# EAGLE design Flipper-ESP32-S2 (EAGLE 7.7.0)
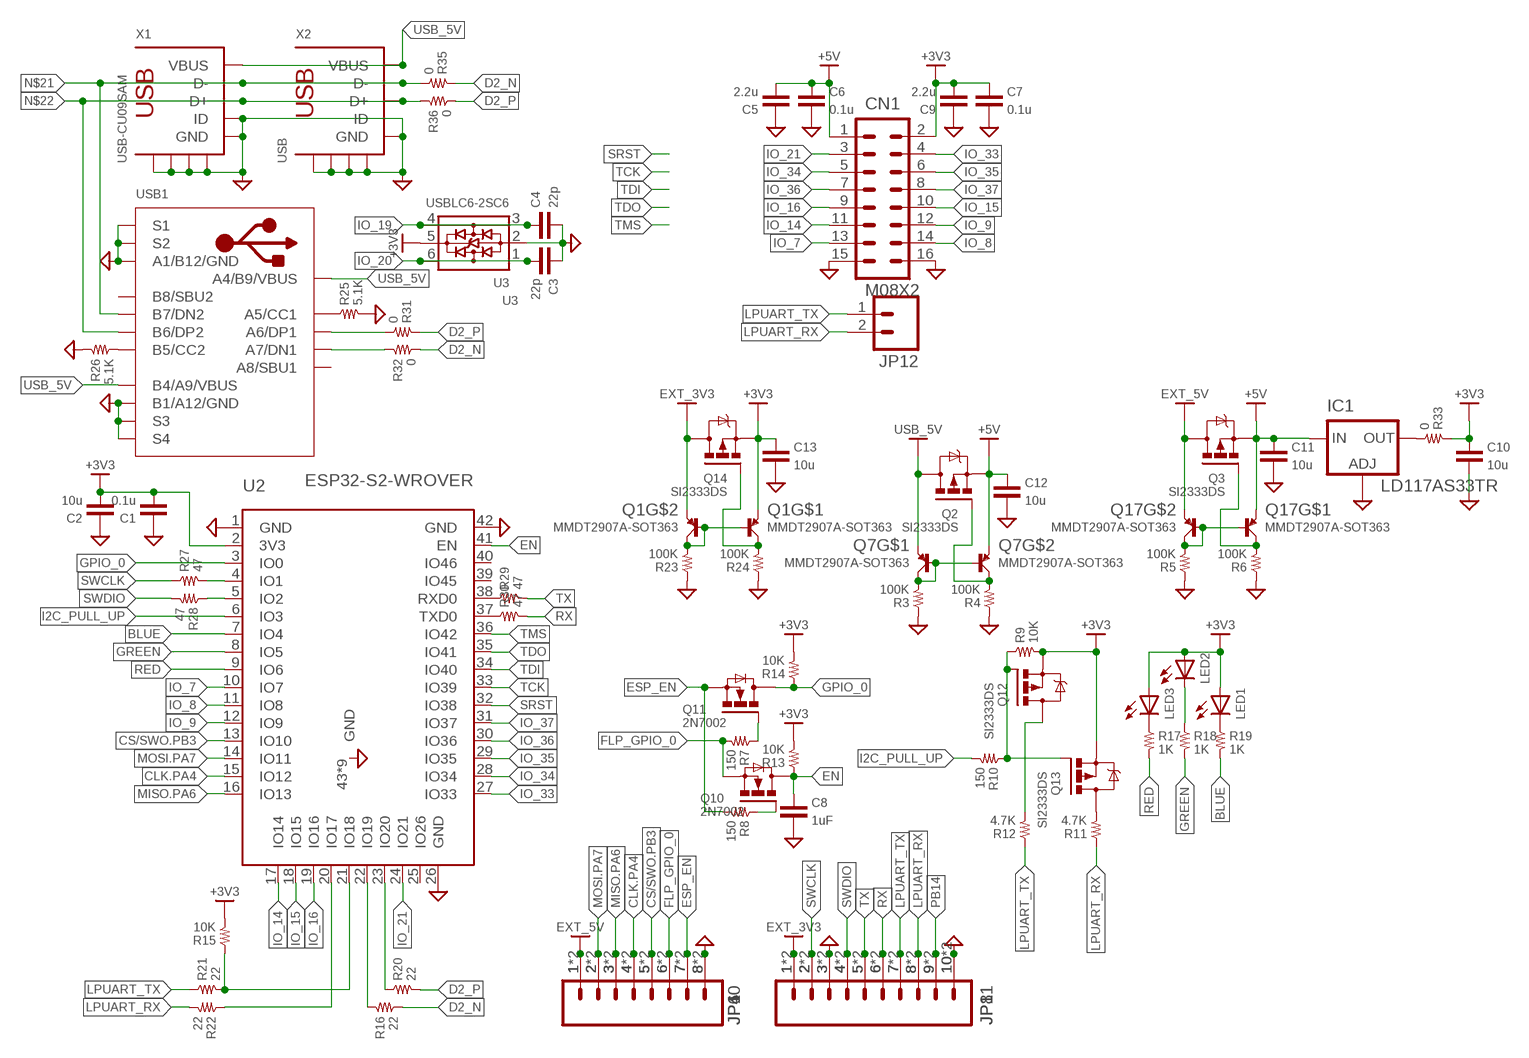
[diagram p0: schematic, sheet 1]

## Parts
C1  0.1u  CAP-0603  [0603]
C2  10u  CAP-0805  [0805]
C3  22p  CAP-0603  [0603]
C4  22p  CAP-0603  [0603]
C5  2.2u  CAP-0603  [0603]
C6  0.1u  CAP-0603  [0603]
C7  0.1u  CAP-0603  [0603]
C8  1uF  CAP-0603  [0603]
C9  2.2u  CAP-0603  [0603]
C10  10u  CAP-0805  [0805]
C11  10u  CAP-0805  [0805]
C12  10u  CAP-0805  [0805]
C13  10u  CAP-0805  [0805]
CN1  M08X2  [2X8]
IC1  LD117AS33TR  [SOT223]
JP1  M10"  [1X10]
JP4  M08SMD-COMBO  [1X08_SMD_COMBINED]
JP6  M081X08  [1X08]
JP8  M10COMBINED  [1X10_SMD_COMBINED]
JP10  M081X08  [1X08]
JP11  M10"  [1X10]
JP12  M02PTH  [1X02]
LED1  LEDCHIPLED_0603  [CHIPLED_0603]
LED2  LEDCHIPLED_0603  [CHIPLED_0603]
LED3  LEDCHIPLED_0603  [CHIPLED_0603]
Q1  MMDT2907A-SOT363  [SOT363]
Q2  SI2333DS  IRLML6401  [SOT-23]
Q3  SI2333DS  IRLML6401  [SOT-23]
Q7  MMDT2907A-SOT363  [SOT363]
Q10  2N7002  MOSFET-N-SOT23  [SOT-23]
Q11  2N7002  MOSFET-N-SOT23  [SOT-23]
Q12  SI2333DS  IRLML6401  [SOT-23]
Q13  SI2333DS  IRLML6401  [SOT-23]
Q14  SI2333DS  IRLML6401  [SOT-23]
Q17  MMDT2907A-SOT363  [SOT363]
R3  100K  RESISTOR-0603  [0603]
R4  100K  RESISTOR-0603  [0603]
R5  100K  RESISTOR-0603  [0603]
R6  100K  RESISTOR-0603  [0603]
R7  150  RESISTOR-0603  [0603]
R8  150  RESISTOR-0603  [0603]
R9  10K  RESISTOR-0603  [0603]
R10  150  RESISTOR-0603  [0603]
R11  4.7K  RESISTOR-0603  [0603]
R12  4.7K  RESISTOR-0603  [0603]
R13  10K  RESISTOR-0603  [0603]
R14  10K  RESISTOR-0603  [0603]
R15  10K  RESISTOR-0603  [0603]
R16  22  RESISTOR-0603  [0603]
R17  1K  RESISTOR-0603  [0603]
R18  1K  RESISTOR-0603  [0603]
R19  1K  RESISTOR-0603  [0603]
R20  22  RESISTOR-0603  [0603]
R21  22  RESISTOR-0603  [0603]
R22  22  RESISTOR-0603  [0603]
R23  100K  RESISTOR-0603  [0603]
R24  100K  RESISTOR-0603  [0603]
R25  5.1K  RESISTOR-0603  [0603]
R26  5.1K  RESISTOR-0603  [0603]
R27  47  RESISTOR-0603  [0603]
R28  47  RESISTOR-0603  [0603]
R29  47  RESISTOR-0603  [0603]
R30  47  RESISTOR-0603  [0603]
R31  0  RESISTOR-0402  [0402]
R32  0  RESISTOR-0402  [0402]
R33  0  RESISTOR-0402  [0402]
R35  0  RESISTOR-0402  [0402]
R36  0  RESISTOR-0402  [0402]
U2  ESP32-S2-WROVER  [ESP32-S2-WROVER]
U3  USBLC6-2SC6  [SOT23-6]
USB1  USB2.0-TYPE-C  [USB2.0-TYPE-C]
X1  USB-CU09SAM  [CU09SAM]
X2  USB  [473460001]

## Nets
5V: C5.1 C6.2 C11.2 C12.2 CN1.1 IC1.3(IN) Q2.2(S) Q3.2(S) Q7.4(E) Q17.1(E) ; supply symbol labelled +5V
+3V3: C1.1 C2.1 C7.2 C9.1 C10.2 C13.2 CN1.2 LED1.A LED2.A LED3.A Q1.1(E) Q12.2(S) Q13.2(S) Q14.2(S) R9.2 R13.2 R14.2 R15.2 R33.1 U2.2(3V3) U3.5(VBUS)
BLUE: R19.2 U2.7(IO4)
CLK.PA4: JP4.4 JP4.4@2 JP6.4 JP10.4 U2.15(IO12)
CS/SWO.PB3: JP4.5 JP4.5@2 JP6.5 JP10.5 U2.13(IO10)
D2_N: R16.2 R32.2 R35.1
D2_P: R20.2 R31.1 R36.2
EN: C8.2 Q10.3(D) R13.1 U2.41(EN)
ESP_EN: JP4.7 JP4.7@2 JP6.7 JP10.7 Q11.2(S) R8.2
EXT_3V3: JP1.1 JP8.1 JP8.1@2 JP11.1 Q1.4(E) Q14.3(D)
EXT_5V: JP4.1 JP4.1@2 JP6.1 JP10.1 Q3.3(D) Q17.4(E)
FLP_GPIO_0: JP4.6 JP4.6@2 JP6.6 JP10.6 Q10.2(S) R7.2
GND: C1.2 C2.2 C3.2 C4.1 C5.2 C6.1 C7.1 C8.1 C9.2 C10.1 C11.1 C12.1 C13.1 CN1.15 CN1.16 IC1.1(ADJ) JP1.3 JP1.10 JP4.8 JP4.8@2 JP6.8 JP8.3 JP8.3@2 JP8.10 JP8.10@2 JP10.8 JP11.3 JP11.10 R3.1 R4.1 R5.1 R6.1 R23.1 R24.1 R25.2 R26.1 U2.1(GND) U2.26(GND) U2.42(GND) U2.43(GND) U2.44(GND) U2.45(GND) U2.46(GND) U2.47(GND) U2.48(GND) U2.49(GND) U2.50(GND) U2.51(GND) U3.2(GND) USB1.A1_B12(A1/B12/GND) USB1.B1_A12(B1/A12/GND) USB1.S1 USB1.S2 USB1.S3 USB1.S4 USB1.S5(S1) USB1.S6(S2) X1.4(ID) X1.5(GND) X1.GND@1(GND) X1.GND@2(GND) X1.GND@3(GND) X1.GND@4(GND) X2.4(ID) X2.5(GND) X2.EP@1(GND) X2.EP@2(GND) X2.EP@3(GND) X2.EP@4(GND)
GPIO_0: Q11.3(D) R14.1 U2.3(IO0)
GREEN: R18.2 U2.8(IO5)
I2C_PULL_UP: R10.2 U2.6(IO3)
IO_7: CN1.13 U2.10(IO7)
IO_8: CN1.14 U2.11(IO8)
IO_9: CN1.12 U2.12(IO9)
IO_14: CN1.11 U2.17(IO14)
IO_15: CN1.10 U2.18(IO15)
IO_16: CN1.9 U2.19(IO16)
IO_17: R22.1 U2.20(IO17)
IO_18: R15.1 R21.2 U2.21(IO18)
IO_19: C4.2 R16.1 U2.22(IO19) U3.3(IO2) U3.4(IO2)
IO_20: C3.1 R20.1 U2.23(IO20) U3.1(IO1) U3.6(IO1)
IO_21: CN1.3 U2.24(IO21)
IO_33: CN1.4 U2.27(IO33)
IO_34: CN1.5 U2.28(IO34)
IO_35: CN1.6 U2.29(IO35)
IO_36: CN1.7 U2.30(IO36)
IO_37: CN1.8 U2.31(IO37)
LPUART_RX: JP1.8 JP8.8 JP8.8@2 JP11.8 JP12.2 R11.1 R22.2
LPUART_TX: JP1.7 JP8.7 JP8.7@2 JP11.7 JP12.1 R12.1 R21.1
MISO.PA6: JP4.3 JP4.3@2 JP6.3 JP10.3 U2.16(IO13)
MOSI.PA7: JP4.2 JP4.2@2 JP6.2 JP10.2 U2.14(IO11)
N$1: Q1.2(B) Q1.3(C) Q1.5(B) R23.2
N$2: Q1.6(C) Q14.1(G) R24.2
N$3: R29.1 U2.38(RXD0)
N$4: LED1.C R19.1
N$5: LED3.C R17.1
N$6: LED2.C R18.1
N$7: R27.2 U2.4(IO1)
N$8: Q12.1(G) Q13.1(G) R9.1 R10.1
N$9: Q12.3(D) R12.2
N$10: Q13.3(D) R11.2
N$11: R28.1 U2.5(IO2)
N$12: R30.1 U2.37(TXD0)
N$14: IC1.2(OUT) IC1.4(OUT) R33.2
N$16: R32.1 USB1.A7(A7/DN1)
N$17: R25.1 USB1.A5(A5/CC1)
N$18: R26.2 USB1.B5(B5/CC2)
N$19: R31.2 USB1.A6(A6/DP1)
N$20: Q11.1(G) R7.1
N$21: R35.2 USB1.B7(B7/DN2) X1.2(D-) X2.2(D-)
N$22: R36.1 USB1.B6(B6/DP2) X1.3(D+) X2.3(D+)
N$23: Q10.1(G) R8.1
N$27: Q7.2(B) Q7.5(B) Q7.6(C) R3.2
N$28: Q2.1(G) Q7.3(C) R4.2
N$29: Q17.2(B) Q17.3(C) Q17.5(B) R5.2
N$30: Q3.1(G) Q17.6(C) R6.2
PB14: JP1.9 JP8.9 JP8.9@2 JP11.9
RED: R17.2 U2.9(IO6)
RX: JP1.6 JP8.6 JP8.6@2 JP11.6 R30.2
SRST: U2.32(IO38)
SWCLK: JP1.2 JP8.2 JP8.2@2 JP11.2 R27.1
SWDIO: JP1.4 JP8.4 JP8.4@2 JP11.4 R28.2
TCK: U2.33(IO39)
TDI: U2.34(IO40)
TDO: U2.35(IO41)
TMS: U2.36(IO42)
TX: JP1.5 JP8.5 JP8.5@2 JP11.5 R29.2
USB_5V: Q2.3(D) Q7.1(E) USB1.A4_B9(A4/B9/VBUS) USB1.B4_A9(B4/A9/VBUS) X1.1(VBUS) X2.1(VBUS)
Unconnected: U2.25(IO26) U2.39(IO45) U2.40(IO46) USB1.A8(A8/SBU1) USB1.B8(B8/SBU2)

## Library data of the parts
C1-C13 = X893:CAP: Capacitor
CN1 = SparkFun-Connectors:M08X2: .1" headers, two rows of 8 each
IC1 = v-reg:LD117A?*: Low drop fixed and adjustable positive voltage regulators 1 A Source: http://www.st.com/stonline/products/literature/ds/7194/ld1117axx.pdf
JP1 JP8 JP11 = SparkFun-Connectors:M10: Header 10 Standard 10-pin 0.1" header. Use with straight break away headers (SKU : PRT-00116), right angle break away headers (PRT-00553), swiss pins (PRT-00743), machine pins (PRT-00117), and female headers (PRT-00115).
JP4 JP6 JP10 = SparkFun-Connectors:M08: Header 8 Standard 8-pin 0.1" header. Use with straight break away headers (SKU : PRT-00116), right angle break away headers (PRT-00553), swiss pins (PRT-00743), machine pins (PRT-00117), and female headers (PRT-00115).
JP12 = SparkFun-Connectors:M02: Header 2 Standard 2-pin 0.1" header. Use with straight break away headers (SKU : PRT-00116), right angle break away headers (PRT-00553), swiss pins (PRT-00743), machine pins (PRT-00117), and female headers (PRT-00115). Molex polarized connector foot print use with SKU : PRT-08233 with associated crimp pins and housings.
LED1-LED3 = led:LED: LED OSRAM: - CHIPLED LG R971, LG N971, LY N971, LG Q971, LY Q971, LO R971, LY R971 LH N974, LH R974 LS Q976, LO Q976, LY Q976 LO Q996 - Hyper CHIPLED LW Q18S LB Q993, LB Q99A, LB R99A - SideLED LS A670, LO A670, LY A670, LG A670, LP A670 LB A673, LV A673, LT A673, LW A673 LH A674 LY A675 LS A676, LA A676, LO A676, LY A676, LW A676 LS A679, LY A679, LG A679 - Hyper Micro SIDELED® LS Y876, LA Y876, LO Y876, LY Y876 LT Y87S - SmartLED LW L88C, LW L88S LB L89C, LB L89S, LG L890 LS L89K, LO L89K, LY L89K LS L896, LA L896, LO L896, LY L896 - TOPLED LS T670, LO T670, LY T670, LG T670, LP T670 LSG T670, LSP T670, LSY T670, LOP T670, LYG T670 LG T671, LOG T671, LSG T671 LB T673, LV T673, LT T673, LW T673 LH T674 LS T676, LA T676, LO T676, LY T676, LB T676, LH T676, LSB T676, LW T676 LB T67C, LV T67C, LT T67C, LS T67K, LO T67K, LY T67K, LW E67C LS E67B, LA E67B, LO E67B, LY E67B, LB E67C, LV E67C, LT E67C LW T67C LS T679, LY T679, LG T679 LS T770, LO T770, LY T770, LG T770, LP T770 LB T773, LV T773, LT T773, LW T773 LH T774 LS E675, LA E675, LY E675, LS T675 LS T776, LA T776, LO T776, LY T776, LB T776 LHGB T686 LT T68C, LB T68C - Hyper Mini TOPLED® LB M676 - Mini TOPLED Santana® LG M470 LS M47K, LO M47K, LY M47K Source: http://www.osram.convergy.de LUXEON: - LUMILED® LXK2-PW12-R00, LXK2-PW12-S00, LXK2-PW14-U00, LXK2-PW14-V00 LXK2-PM12-R00, LXK2-PM12-S00, LXK2-PM14-U00 LXK2-PE12-Q00, LXK2-PE12-R00, LXK2-PE12-S00, LXK2-PE14-T00, LXK2-PE14-U00 LXK2-PB12-K00, LXK2-PB12-L00, LXK2-PB12-M00, LXK2-PB14-N00, LXK2-PB14-P00, LXK2-PB14-Q00 LXK2-PR12-L00, LXK2-PR12-M00, LXK2-PR14-Q00, LXK2-PR14-R00 LXK2-PD12-Q00, LXK2-PD12-R00, LXK2-PD12-S00 LXK2-PH12-R00, LXK2-PH12-S00 LXK2-PL12-P00, LXK2-PL12-Q00, LXK2-PL12-R00 Source: www.luxeon.com KINGBRIGHT: KA-3528ASYC Source: www.kingbright.com
Q1 Q7 Q17 = X893:MMDT2907A
Q2 Q3 Q12-Q14 = X893:IRLML640: http://www.terraelectronica.ru/pdf/IR/IRLML6401.pdf http://www.terraelectronica.ru/pdf/IR/IRLML6402.pdf
Q10 Q11 = X893:MOSFET-N
R3-R33 R35 R36 = X893:RESISTOR
U2 = X893:ESP32-S2-WROVER
U3 = X893:USBLC6: USBLC6-2SC6 <https://www.terraelectronica.ru/show_pdf.php?pdf=%2Fds%2Fpdf%2Fu%2Fusblc62sc6.pdf>
USB1 = X893:USB2.0-TYPE-C
X1 X2 = X893:USB: USB Connectors USB-B-PTH is fully proven SKU : PRT-00139 USB-miniB is fully proven SKU : PRT-00587 USB-A-PCB is untested. USB-A-H is throughly reviewed, but untested. Spark Fun Electronics SKU : PRT-00437 USB-B-SMT is throughly reviewed, but untested. Needs silkscreen touching up. USB-A-S has not been used/tested USB-MB-H has not been used/tested

## Board
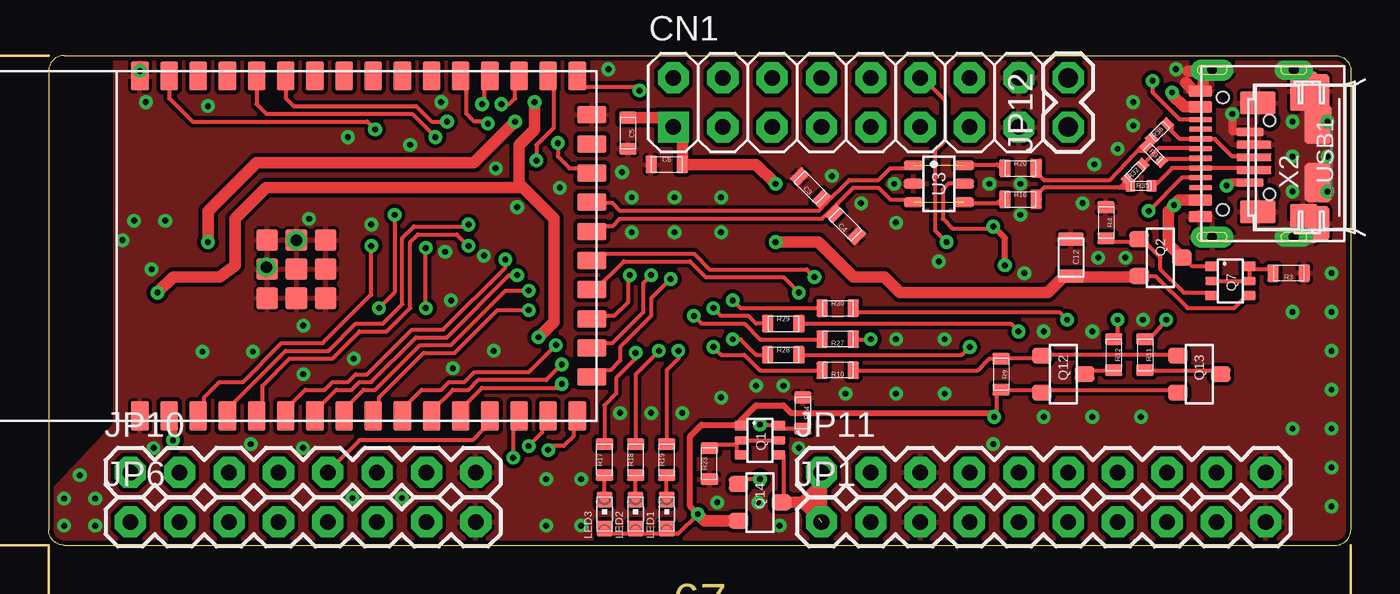
[diagram p1: board, top side]
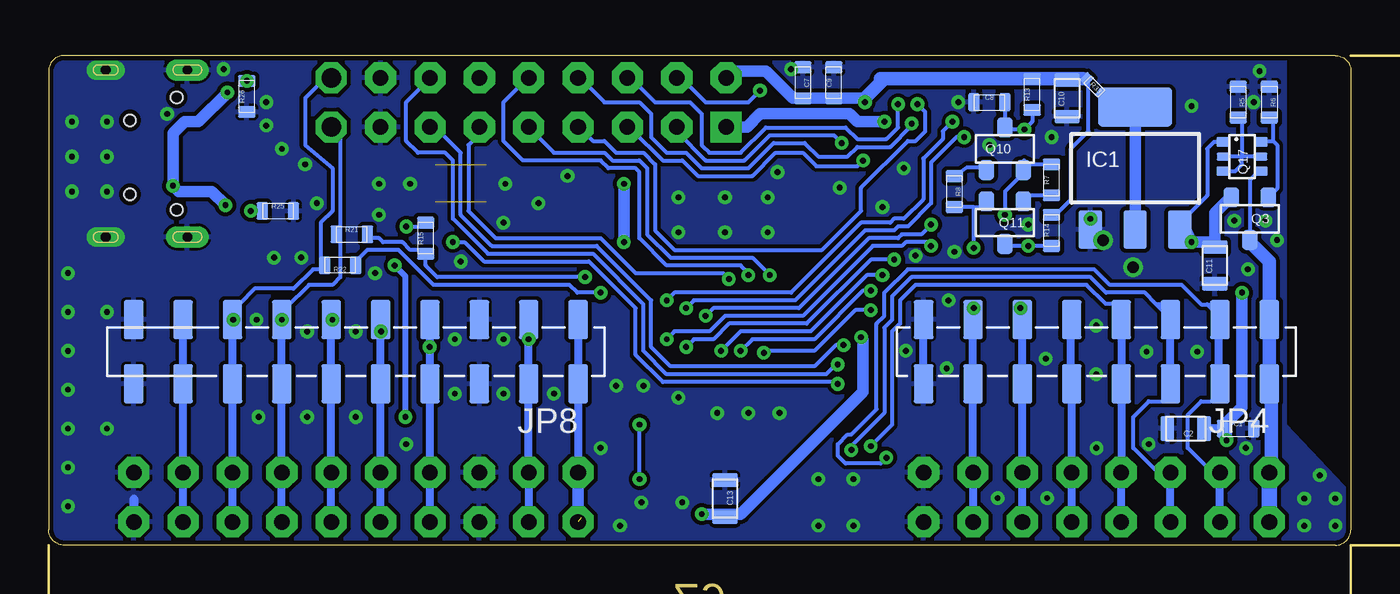
[diagram p2: board, bottom side, seen from below]

Size 67 x 25.2 mm. Coordinates in mm from the lower left corner, seen from the top.
Outline: 0.8,0 66.2,0 arc90 67,0.8 67,24.4 arc90 66.2,25.2 0.8,25.2 arc90 0,24.4 0,0.8 arc90 0.8,0
Copper layers (1+16): Top 0.018mm / dielectric 0.8mm / Bottom 0.018mm
Design rules "Rezonit-020-020 *": minimum track width 0.2mm, minimum drill 0.3mm, track to track 0.2mm, track to pad 0.2mm, pad to pad 0.2mm, via to via 0.2mm, smd to smd 0mil, copper to edge 0.25mm, drill to drill 0.3mm, minimum pad ring 0.2mm, minimum via ring 0.2mm, stop-mask expansion 4mil, vias tented up to drill 0.4mm, thermal gap 0.15mm
Milling: area -4.3,0 to -3.7,1.5; area -4.3,23.7 to -3.7,25.2; area -6.2,9.8 to -4.4,15.4; area 0,-4.4 to 1.5,-3.8; area 65.5,-4.4 to 67,-3.8; area 32.1,-3.7 to 34.9,-1.9; 6 lines

### Footprints (pad centres in the part's own frame; a part is rotated, then mirrored left to right if it is on the bottom)
0603 = smd 0.6 x 0.9: 1 -0.8,0; 2 0.8,0
0805 = smd 0.7 x 1.3: 1 -0.95,0; 2 0.95,0
2X8 = drill 0.8 pad 1.6 square: 1 0,0 | drill 0.8 pad 1.6 octagon: 2 0,2.54; 3 2.54,0; 4 2.54,2.54; 5 5.08,0; 6 5.08,2.54; 7 7.62,0; 8 7.62,2.54; 9 10.16,0; 10 10.16,2.54; 11 12.7,0; 12 12.7,2.54; 13 15.24,0; 14 15.24,2.54; 15 17.78,0; 16 17.78,2.54
SOT223 = smd 1.2 x 2: 1 -2.3,-3.15; 2 0,-3.15; 3 2.3,-3.15 | smd 3.8 x 2: 4 0,3.15
1X10 = drill 0.8 pad 1.6 octagon: 1 0,0; 2 2.54,0; 3 5.08,0; 4 7.62,0; 5 10.16,0; 6 12.7,0; 7 15.24,0; 8 17.78,0; 9 20.32,0; 10 22.86,0
1X08_SMD_COMBINED = smd 1 x 2: 1 0,1.65; 1@2 0,-1.65; 2 2.54,-1.65; 2@2 2.54,1.65; 3 5.08,1.65; 3@2 5.08,-1.65; 4 7.62,-1.65; 4@2 7.62,1.65; 5 10.16,1.65; 5@2 10.16,-1.65; 6 12.7,-1.65; 6@2 12.7,1.65; 7 15.24,1.65; 7@2 15.24,-1.65; 8 17.78,-1.65; 8@2 17.78,1.65
1X08 = drill 0.8 pad 1.6 octagon: 1 0,0; 2 2.54,0; 3 5.08,0; 4 7.62,0; 5 10.16,0; 6 12.7,0; 7 15.24,0; 8 17.78,0
1X10_SMD_COMBINED = smd 1 x 2: 1 0,1.65; 1@2 0,-1.65; 2 2.54,-1.65; 2@2 2.54,1.65; 3 5.08,1.65; 3@2 5.08,-1.65; 4 7.62,-1.65; 4@2 7.62,1.65; 5 10.16,1.65; 5@2 10.16,-1.65; 6 12.7,-1.65; 6@2 12.7,1.65; 7 15.24,1.65; 7@2 15.24,-1.65; 8 17.78,-1.65; 8@2 17.78,1.65; 9 20.32,-1.65; 9@2 20.32,1.65; 10 22.86,-1.65; 10@2 22.86,1.65
1X02 = drill 1 pad 1.6 octagon: 1 0,0; 2 2.54,0
CHIPLED_0603 = smd 0.8 x 0.8: A 0,-0.75; C 0,0.75
SOT363 = smd 0.5 x 0.7: 1 -0.75,-0.95; 3 0.75,-0.95; 4 0.75,0.95; 6 -0.75,0.95 | smd 0.4 x 0.7: 2 0,-0.95; 5 0,0.95
SOT-23 = smd 0.8 x 1: 1 -0.95,-1.1; 2 0.95,-1.1; 3 0,1.1
0402 = smd 0.5 x 0.6: 1 -0.55,0; 2 0.55,0
ESP32-S2-WROVER = smd 1.5 x 0.9: 1 -8.75,11.5; 2 -8.75,10; 3 -8.75,8.5; 4 -8.75,7; 5 -8.75,5.5; 6 -8.75,4; 7 -8.75,2.5; 8 -8.75,1; 9 -8.75,-0.5; 10 -8.75,-2; 11 -8.75,-3.5; 12 -8.75,-5; 13 -8.75,-6.5; 14 -8.75,-8; 15 -8.75,-9.5; 16 -8.75,-11; 27 8.75,-11; 28 8.75,-9.5; 29 8.75,-8; 30 8.75,-6.5; 31 8.75,-5; 32 8.75,-3.5; 33 8.75,-2; 34 8.75,-0.5; 35 8.75,1; 36 8.75,2.5; 37 8.75,4; 38 8.75,5.5; 39 8.75,7; 40 8.75,8.5; 41 8.75,10; 42 8.75,11.5 | smd 0.9 x 1.5: 17 -6.75,-11.75; 18 -5.25,-11.75; 19 -3.75,-11.75; 20 -2.25,-11.75; 21 -0.75,-11.75; 22 0.75,-11.75; 23 2.25,-11.75; 24 3.75,-11.75; 25 5.25,-11.75; 26 6.75,-11.75 | smd 1.1 x 1.1: 43 -1.19,3.45; 44 0.31,3.45; 45 0.31,4.95; 46 -1.19,4.95; 47 -2.69,4.95; 48 -2.69,3.45; 49 -2.69,1.95; 50 -1.19,1.95; 51 0.31,1.95
SOT23-6 = smd 1 x 0.5: 1 -1.3,0.95; 2 -1.3,0; 3 -1.3,-0.95; 4 1.3,-0.95; 5 1.3,0; 6 1.3,0.95
USB2.0-TYPE-C = smd 1.2 x 0.6: A1_B12 0.05,3.25; A4_B9 0.05,2.4; B1_A12 0.05,-3.2; B4_A9 0.05,-2.4 | smd 1.2 x 0.3: A5 0.05,1.25; A6 0.05,0.25; A7 0.05,-0.25; A8 0.05,-1.25; B5 0.05,-1.75; B6 0.05,-0.75; B7 0.05,0.75; B8 0.05,1.75 | drill 0.5 pad 1 long: S1 -4.75,4.3; S2 -4.75,-4.3 | drill 0.5 pad 1.1 long: S3 -0.55,4.3; S4 -0.55,-4.3 | smd 1.4 x 2: S5 -6,1.5; S6 -6,-1.5 | hole 0.6: -1.1,-2.89; -1.1,2.89
CU09SAM = smd 0.4 x 0.8: 1 1.3,-5.1; 5 -1.3,-5.1 | smd 0.4 x 1.3: 2 0.65,-4.85; 3 0,-4.85; 4 -0.65,-4.85 | smd 1.8 x 1.9: GND@1 -3.4,-2.15; GND@4 3.4,-2.15 | smd 1 x 1: GND@2 -3.2,-2.2; GND@3 3.2,-2.2 | hole 0.6: -1.9,-4.3; 1.9,-4.3
473460001 = smd 0.4 x 1.4: 1 -1.3,4.9; 2 -0.65,4.9; 3 0,4.9; 4 0.65,4.9; 5 1.3,4.9 | smd 1.2 x 1.8: EP@1 -2.8,4.5; EP@3 2.8,4.5 | smd 2 x 1.4: EP@2 -3.4,2.15; EP@4 3.4,2.15

### Placement (x,y rotation side)
C1  5.8,6 0 bottom
C2  8.5,6 180 bottom
C3  39.2,18.4 135 top
C4  41,16.5 135 top
C5  29.8,21.2 270 top
C6  31.8,19.6 0 top
C7  28.2,23.8 270 bottom
C8  18.6,22.8 0 bottom
C9  26.6,23.8 90 bottom
C10  14.6,23 90 bottom
C11  7,14.4 90 bottom
C12  52.6,14.8 270 top
C13  32.2,2.4 270 bottom
CN1  32.14,21.52 0 top
IC1  11.1,19.4 0 bottom
JP1  39.76,1.2 0 top
JP4  4.2,9.96 180 bottom
JP6  4.2,1.2 0 top
JP8  39.76,9.96 180 bottom
JP10  4.2,3.74 0 top
JP11  39.76,3.74 0 top
JP12  52.46,21.52 90 top
LED1  31.8,1.6 0 top
LED2  30.2,1.6 0 top
LED3  28.6,1.6 0 top
Q1  36.6,5.4 270 top
Q2  57.2,14.8 270 top
Q3  5.2,16.8 180 bottom
Q7  60.8,13.6 270 top
Q10  17.8,20.4 0 bottom
Q11  17.8,16.6 180 bottom
Q12  52.2,8.8 270 top
Q13  59.2,8.8 270 top
Q14  36.6,2.2 270 top
Q17  5.6,20 270 bottom
R3  63.8,14 180 top
R4  54.4,16.6 270 top
R5  5.8,22.8 270 bottom
R6  4.2,22.8 270 bottom
R7  15.4,18.8 90 bottom
R8  20.4,18.2 270 bottom
R9  49,8.8 270 top
R10  40.6,9 180 top
R11  56.4,9.8 270 top
R12  54.8,9.8 270 top
R13  16.4,23.2 90 bottom
R14  15.4,16.2 90 bottom
R15  47.6,15.8 90 bottom
R16  50,17.8 0 top
R17  28.6,4.4 90 top
R18  30.2,4.4 90 top
R19  31.8,4.4 90 top
R20  50,19.4 0 top
R21  51.4,16 0 bottom
R22  52,14.4 180 bottom
R23  34,4.2 90 top
R24  38.8,6.8 270 top
R25  55.2,17.2 0 bottom
R26  56.8,23.1 90 bottom
R27  40.6,10.6 180 top
R28  37.8,9.8 0 top
R29  37.8,11.4 0 top
R30  40.6,12.2 0 top
R31  56.85,20.15 315 top
R32  55.9,19.2 225 top
R33  13.2,23.6 315 bottom
R35  56.2,18.5 0 top
R36  57.15,21.3 225 top
U2  16.2,15.4 90 top
U3  45.8,18.6 0 top
USB1  59.31,20.16 180 top
X1  67.11,19.96 270 top
X2  66.71,19.96 90 top

### Tracks (layer width: path | path; a pad name or v marks a point on that pad's centre or on a via)
5V  (via drill 0.3)
  Top 0.2: Q7.4 61.7,12.8 61.6,12.8 61,12.2 58.6,12.2 56.95,13.85 Q2.2 56.05,13.8 55.8,13.8 | C12.2 52.75,13.85 52.8,13.8
  Top 0.6: v24,21.8 21.9,19.7 10.7,19.7 8.2,17.2 v8.2,15.6 | C5.1 32.2,22 32.2,21.58 CN1.1 32.6,21.38 C6.2 36.4,19.6 v37.4,18.6 | v37.4,15.6 39.6,15.6 41.4,13.8 43,13.8 43.8,13 51.4,13 52.2,13.8 52.8,13.8 55.8,13.8
  Bottom 0.2: Q17.1 7.05,20.75 7.4,20.4 7.4,18 8.4,17 8.4,15.6 | 7,15.6 C11.2
  Bottom 0.6: CN1.1 31.08,21.52 30.4,22.2 25.8,22.2 25.4,21.8 v24,21.8 | v8.2,15.6 8.6,16.45 IC1.3 8.65,16.25 8.6,15.8 8.35,15.55 | v8.2,15.6 8.4,15.6 | v8.2,15.6 7,15.6 7,17.1 6.3,17.8 6.2,17.8 Q3.2 | v37.4,18.6 v37.4,15.6
+3V3  (via drill 0.3)
  Top 0.2: U3.5 46.3,18.6 46,18.3 46,16.8 46.5,16.3 48.5,16.3 v48.6,16.4 | Q13.2 57.95,8 51.2,8 51.1,7.9 Q12.2 50.95,8 R9.2 48.8,8 48.8,6.75 v48.65,6.6 | LED3.A 28.6,0.6 30.2,0.6 | LED2.A 30.2,0.6 | 30.2,0.6 31.8,0.6 | LED1.A 31.8,0.6 | 31.8,0.6 32.4,0.6 v33.4,1.6
  Top 0.3: v49.2,14.4 49.2,15.8 v48.6,16.4 | v33.4,1.6 33,2 33,5.6 33.6,6.2 35.4,6.2 | v48.65,6.6 48.45,6.8 38.2,6.8 37.8,7.2 36.4,7.2 35.8,6.6 | 35.4,6.2 35.5,6.2 Q1.1 35.8,6.3 35.8,6.6 | 35.8,6.6 35.4,6.2
  Top 0.4: U2.2 6.2,6.6 6.4,6.4 v6.4,5.4
  Top 0.6: v5.6,13 6.4,13.8 8.8,13.8 9.6,14.4 9.6,16.8 11.2,18.4 24.4,18.4 | v25,22.8 25,21.4 24.2,20.6 24.2,18.6 24.4,18.4 | 24.4,18.4 26,16.8 26,11.5 v25.2,10.7 | Q14.2 33.75,1.25 v33.4,1.6
  Bottom 0.2: R14.2 15.2,17 14.4,17.8 14.4,20.4 13.5,21.3 13.5,23.98 R33.1 13.8,24 | v48.6,16.4 47.8,16.4 R15.2 | C13.2 32.2,1.6
  Bottom 0.3: v49.2,14.4 48.65,13.85 v48.65,6.6
  Bottom 0.4: v6.4,5.4 6.6,5.6 C1.1 C2.1 | C10.2 14.2,24
  Bottom 0.6: v6.4,5.4 6.4,6.3 5.6,7.1 v5.6,13 | CN1.2 32,24.4 30.1,24.4 28.7,23 C7.2 C9.1 25,23 v25,22.8 | 24.2,23.8 24.2,24 | v25.2,10.7 25.1,10.6 25.1,7.9 31.4,1.6 32.2,1.6 v33.4,1.6
  Bottom 0.7: 25,23 24.2,23.8 | 24.2,24 R13.2 14.2,24 13.8,24
BLUE  (via drill 0.3)
  Top 0.2: U2.7 14,6.95 14,7.2 14.8,8 15.6,8 16,8.4 16.6,8.4 18.9,10.7 20.5,10.7 23.7,13.9 v24.1,13.9 | v32.4,10 32.4,9.6 31.8,9 R19.2
  Bottom 0.2: v24.1,13.9 24.9,13.9 27.8,11 31.4,11 v32.4,10
CLK.PA4  (via drill 0.3)
  Top 0.2: U2.15 25.7,6.5 25.4,6.2 25.4,5.8 v24.7,5.1
  Bottom 0.2: JP4.4 12,11.8 12,12.4 12.02,12.42 12.62,12.42 13.6,13.4 22.4,13.4 23.2,12.6 23.2,11.4 23.6,11 23.6,6.2 v24.7,5.1
  Bottom 0.4: JP4.4 JP4.4@2 JP10.4 JP6.4
CS/SWO.PB3
  Top 0.2: 23,6.6 22.7,6.9 U2.13 22.7,6.5 22.4,6.2 22.4,6 21.8,5.4 16,5.4 14.8,4.2 14.8,4.18 JP10.5
  Bottom 0.2: JP4.5 14.4,8.4
  Bottom 0.4: JP6.5 JP10.5 JP4.5 | 14.4,8.4 14.4,11.57 JP4.5@2
D2_N
  Top 0.2: R35.1 R32.2 55.1,18.4 | 55.6,18.8 55.6,18.4 R35.1 | 55.1,18.4 51.2,18.4 51,18.2 50.6,18.2 50.6,17.4 51,17.4 51,17.8 R16.2 | 55.1,18.4 55.4,18.4 | 55.4,18.4 R35.1 | 55.4,18.4 55.4,18.6
D2_P
  Top 0.2: R31.1 56.35,20.53 56.35,20.6 56.3,20.6 54.6,18.8 51.2,18.8 51,19 50.6,19 50.6,19.8 51,19.8 51,19.4 R20.2 | R31.1 R36.2 | R36.2 56.35,20.55 | 56.41,20.61 R36.2 | 56.1,20.3 56.2,20.3 | 56.2,20.3 56.4,20.3 56.6,20.5 | 56.2,20.3 56.2,20.4 56.32,20.4 R31.1
EN  (via drill 0.3)
  Top 0.2: U2.41 6.2,23 7.4,21.8 16.4,21.8 v16.8,21.4
  Bottom 0.2: R13.1 16.4,21.8 v16.8,21.4 17.7,21.4 Q10.3 C8.2
ESP_EN  (via drill 0.3)
  Top 0.2: v19.4,12.2 v19.4,15.3
  Bottom 0.2: 19.44,11.96 v19.4,12.2 | v19.4,15.3 19.4,17.4 | 19.4,17.4 19,17.4 18.8,17.6 18.8,17.65 Q11.2 | 19.4,17.4 R8.2
  Bottom 0.4: JP6.7 JP10.7 JP4.7 JP4.7@2 19.44,12.16 v19.4,12.2
EXT_3V3  (1 unrouted)
  Top 0.2: Q1.4 37.8,4.65 37.8,2.3 Q14.3
  Top 0.6: Q14.3 38.8,2.2 | 38.8,2.2 39.74,2.2 | 38.8,2.2 39.6,1.4 | 38.8,2.2 39.6,3 | JP11.1 JP1.1
  Bottom 0.4: JP8.1@2 JP8.1 JP11.1
  Bottom 0.6: JP11.1 JP1.1
EXT_5V
  Bottom 0.2: JP6.1 JP10.1 | Q17.4 4.7,19.2 4.8,19.2 5.2,18.8 Q3.3
  Bottom 0.7: 4.2,7.6 JP4.1 JP4.1@2 4.2,14.6 5.2,15.6 Q3.3 | 4.1,4.3 4.1,7.5
  Bottom 0.8: JP6.1 4.2,4.2 4.1,4.3 | 4.1,7.5 4.2,7.6
FLP_GPIO_0  (via drill 0.3)
  Top 0.2: v17.8,17 17.8,13 v17,12.2
  Bottom 0.2: R7.2 16.95,19.6 Q10.2 | Q10.2 16.9,19.7 16.8,19.8 | Q10.2 16.85,19.15 17.8,18.2 v17.8,17 | v17,12.2 17,11.71 JP4.6
  Bottom 0.4: JP4.6 JP4.6@2 JP10.6 JP6.6
GND  (via drill 0.3, 0.6)
  Top 0.2: X1.GND@2 64.91,23.31 X1.GND@1 | X1.GND@4 64.96,16.71 X1.GND@3 | 59.4,24.4 59.8,24.4 USB1.S4
  Top 0.4: v60.9,22.2 60.9,21.3 62.3,21.3
  Top 0.6: 58.5,23.8 58.9,23.4 59.4,23.4 59.4,24.4 58.6,24.4
  Bottom 0.4: 62.62,1.18 JP1.10 62.62,2.4 62.6,2.4 62.6,1.2 62.62,1.18
  other vias: 0.8,1 2.4,2.4 0.8,2.4 2.4,1 13.09,5 7.91,9.96 10.4,5.2 5.4,5 3.8,15.7 10.51,9.96 6,16.7 8.2,22.6 13.4,16.8 15.7,9.6 13.1,8.8 55.8,22.8 58,24.5 64,20 65.8,20 65.8,21.8 64,21.8 64,18.2 65.8,18.2 28.8,24.5 29.5,19.2 30,16.1 32.2,16.1 30,17.9 32.2,17.9 15.4,21 18.6,20.6 20.2,22.8 23,19.4 4.4,16.7 20.7,12.6 20.8,9.1 15.63,2.42 18.17,2.42 22.4,14.9 34.6,17.9 34.6,16.1 24.1,17.4 41.8,17.6 40.3,19 50,17 43.5,18.6 56.2,6.6 53.2,17.6 53.8,19.6 55.8,21.6 55,20.4 48.4,18.6 50,18.6 43.6,16.6 46.1,10.6 43.6,10.6 45.8,14.6 34.4,2.2 37.6,1 27.4,1 25.6,1 25.6,3.4 27.4,3.4 38.6,5 32.6,6.8 34.6,7.6 36.4,8.2 37.8,8.2 31,6.8 29.4,6.8 41,7.8 43.6,7.8 46.1,7.8 36.5,2.2 48.6,5.2 51.2,6.6 53.7,6.6 54,14.8 55.4,14.8 4.7,24.4 20.4,15.1 16.6,16.5 11.2,14.3 12.75,15.7 22.9,10 13.1,11.3 5.3,14.2 53.7,11 56.3,11.6 51.2,11 50.2,14 26.3,18.4 5,22.8 64,6 66,14 66,12 66,10 66,8 66,6 66,4 66,2 64,12 1.6,3.6
  pour Top: 0,0.2 67,0.2 67,25.2 3.4,25.2 3.4,6.2 0,2.6
  pour Bottom: 0,0.2 67,0.2 67,25.2 3.4,25.2 3.4,6.2 0,2.6
GPIO_0  (via drill 0.3)
  Top 0.2: U2.3 8,6.95 8,7.6 8.8,8.4 10,8.4 12,10.4 14.1,10.4 16.6,12.9 v16.6,15.4
  Bottom 0.2: Q11.3 17.7,15.4 v16.6,15.4 R14.1
GREEN  (via drill 0.3)
  Top 0.2: U2.8 15.4,6.85 15.4,7.2 16.2,8 16.8,8 19.1,10.3 20.7,10.3 23.5,13.1 v24.7,13.1 | v31.4,10 30.2,8.8 R18.2
  Bottom 0.2: v24.7,13.1 25.1,13.1 27.6,10.6 30.8,10.6 v31.4,10
I2C_PULL_UP  (via drill 0.3)
  Top 0.2: U2.6 12.4,6.85 12.4,7.2 13.2,8 14.2,8 14.6,8.4 15.4,8.4 15.8,8.8 16.4,8.8 18.7,11.1 20.3,11.1 23.5,14.3 v23.5,14.7 | v34.2,10.2 34.6,9.8 35.8,9.8 36.6,9 R10.2
  Bottom 0.2: v23.5,14.7 24.7,14.7 28,11.4 32,11.4 32.8,10.6 33.8,10.6 v34.2,10.2
IO_7  (via drill 0.3)
  Top 0.2: U2.10 18.2,7 19.2,8 20.2,8 20.6,8.4 21.4,8.4 21.9,8.9 24.7,8.9 v26.1,10.3
  Bottom 0.2: v26.1,10.3 26.5,10.3 27.6,9.2 35,9.2 36,10.2 36,12.6 38.8,15.4 44.2,15.4 45.8,17 45.8,20.2 46.8,21.2 47.06,21.2 CN1.13
IO_8  (via drill 0.3)
  Top 0.2: U2.11 19.7,6.9 20.8,8 21.6,8 22.1,8.5 25.6,8.5 v26.4,9.3
  Bottom 0.2: v26.4,9.3 26.5,9.3 27,8.8 35.2,8.8 36.4,10 36.4,12.4 39,15 44.4,15 46.2,16.8 46.2,19.8 46.6,20.2 48,20.2 48.6,20.8 48.6,22.8 47.8,23.6 47.8,23.64 CN1.14
IO_9  (via drill 0.3)
  Top 0.2: U2.12 21.4,7.2 22.3,8.1 26.3,8.1 v26.4,8.3 | CN1.12 45.1,23.8 45.2,23.8 46.1,22.9 46.1,20.8 45.6,20.3 45.6,16.2 v46.2,15.6
  Bottom 0.2: v26.4,8.3 26.5,8.3 26.6,8.4 35.4,8.4 36.8,9.8 36.8,12.2 39.2,14.6 44.6,14.6 45.6,15.6 v46.2,15.6
IO_14  (via drill 0.3)
  Top 0.2: v32,13.7 31,12.7 31,11.8 29.4,10.2 29.4,9.5 28.9,9 28,9 U2.17
  Bottom 0.2: CN1.11 44.84,21.44 44.8,21.2 45.4,20.6 45.4,17.2 44,15.8 38.6,15.8 36.8,14 32.3,14 v32,13.7
IO_15  (via drill 0.3)
  Top 0.2: U2.18 28.35,10.15 28.6,10.4 29,10.4 30.6,12 30.6,13.5 v31,13.9
  Bottom 0.2: v31,13.9 31,14 31.4,14.4 35.2,14.4 36.6,15.8 36.6,19.2 36.8,19.4 38.2,19.4 38.6,19.8 42.6,19.8 43.6,20.8 43.6,22.8 42.8,23.6 42.76,23.6 CN1.10
IO_16  (via drill 0.3)
  Top 0.2: v29.9,13.9 29.8,13.8 29.8,12.5 29.1,11.8 27.7,11.8 U2.19
  Bottom 0.2: CN1.9 41.9,21.1 41,20.2 38.4,20.2 38,19.8 36.6,19.8 36.2,19.4 36.2,16 35,14.8 30.8,14.8 v29.9,13.9
IO_17  (via drill 0.3)
  Top 0.2: U2.20 28.15,13.15 29.6,14.6 33,14.6 33.8,13.8 37.8,13.8 v38.6,13
  Bottom 0.2: v38.6,13 39.8,13 40.2,13.4 47.2,13.4 49,15.2 50.6,15.2 51.2,14.6 R22.1
IO_18  (via drill 0.3)
  Top 0.2: U2.21 28.4,14.65 28.4,15 33.2,15 34,14.2 39,14.2 v39.4,13.8
  Bottom 0.2: v39.4,13.8 47,13.8 47.6,14.4 R15.1 47.8,15.2 48.4,15.2 48.8,15.6 49.8,15.6 50,15.8 50.6,15.8 R21.2
IO_19  (1 unrouted)
  Top 0.2: 40.2,17.2 39.8,16.8 29.4,16.8 29,16.4 28.2,16.4 U2.22 | 40.2,17.2 41.4,18.4 42.7,18.4 43.3,17.8 44.35,17.8 U3.3 | 48.8,17.6 47.15,17.6 U3.4 | 48.8,17.6 49.2,17.6 R16.1 | 48.8,17.6 49,17.8 | C4.2 40.33,17.07 40.2,17.2
IO_20  (1 unrouted)
  Top 0.2: 40,17.6 39.6,17.2 29.4,17.2 29,17.6 27.95,17.6 U2.23 | 40,17.6 41.2,18.8 42.7,18.8 43.3,19.4 44.35,19.4 U3.1 | 48.8,19.6 47.15,19.6 U3.6 | 48.8,19.6 49.2,19.6 R20.1 | 48.8,19.6 49,19.4 | C3.1 40,17.6
IO_21  (via drill 0.3)
  Top 0.2: v26.2,20.7 26.2,20 26.8,19.4 27.8,19.4 27.8,19.2 27.9,19.2 U2.24
  Bottom 0.2: CN1.3 34.68,21.28 33.2,19.8 31.2,19.8 29.9,21.1 26.6,21.1 v26.2,20.7
IO_33  (via drill 0.3)
  Top 0.2: U2.27 27.25,24.15 27.4,24.2 27.2,24.2 27.2,23.6 30.2,23.6 v30.4,23.4
  Bottom 0.2: CN1.4 34.46,24.06 33.2,22.8 31,22.8 v30.4,23.4
IO_34  (via drill 0.3)
  Top 0.2: U2.28 26,24.05 26,21.5 25.1,20.6 v25.1,19.8
  Bottom 0.2: CN1.5 37.22,21.42 37,21.4 35.4,19.8 34.4,19.8 33.6,19 30.8,19 29.6,20.2 28.2,20.2 27.5,19.5 25.4,19.5 v25.1,19.8
IO_35  (via drill 0.3)
  Top 0.2: v23.3,22.7 23.7,22.7 24,23 24,23.8 U2.29
  Bottom 0.2: CN1.6 37.06,24.06 35.8,22.8 34,22.8 33.4,22.2 33.4,20.6 33,20.2 31.4,20.2 30.1,21.5 26,21.5 25.4,20.9 23.9,20.9 23.3,21.5 v23.3,22.7
IO_36  (via drill 0.3)
  Top 0.2: U2.30 22.7,24.1 22.4,23.8 22.4,22.8 v22.3,22.7
  Bottom 0.2: CN1.7 39.72,21.52 39,20.8 38.4,20.8 37.8,20.2 36.4,20.2 35.8,19.6 35.8,16.2 34.8,15.2 27.2,15.2 25.2,17.2 25.2,18.4 22.8,20.8 22.4,20.8 21.9,21.3 21.9,22.3 v22.3,22.7
IO_37  (via drill 0.3)
  Top 0.2: v22.6,21.7 22.6,21.8 21.9,21.8 21.5,22.2 21.5,23.8 U2.31
  Bottom 0.2: CN1.8 39.66,24.06 38.4,22.8 36.6,22.8 36,22.2 36,21 35.2,20.2 34.2,20.2 33.4,19.4 31,19.4 29.7,20.7 28.1,20.7 27.4,20 25.9,20 25.4,20.5 23.7,20.5 22.6,21.6 v22.6,21.7
LPUART_RX  (via drill 0.3)
  Top 0.2: R11.1 56.4,10.8 56.8,10.8 v57.5,11.6
  Bottom 0.2: v57.5,11.6 57.54,11.44 JP8.8 57.2,11.95 57.2,12.4 56.4,13.2 54.4,13.2 53.4,14.2 53,14.2 R22.2 53,14.4 53,16.6 52.4,17.2 52.4,19.4 53.8,20.6 53.8,23 52.74,24.06 JP12.2
  Bottom 0.4: JP8.8 JP8.8@2 JP11.8 JP1.8
LPUART_TX  (via drill 0.3)
  Top 0.2: R12.1 55,10.6 v55,11.6
  Bottom 0.2: JP12.1 52,21 52,16 | R21.1 52,16 | 52,16 52,13.8 52.4,13.4 53.6,13.4 54.8,12.2 54.8,11.81 JP8.7@2
  Bottom 0.4: JP8.7@2 v55,11.6 JP8.7 JP11.7 JP1.7
MISO.PA6  (via drill 0.3)
  Top 0.2: U2.16 27,6.4 27,5.6 26.5,5.1 25.7,5.1 v25.7,4.9
  Bottom 0.2: 9.28,12.08 9.6,12.4 10,12.4 | 10,12.4 10.6,13 12.6,13 13.4,13.8 22.6,13.8 23.6,12.8 23.6,11.6 24,11.2 24,6.8 25.7,5.1 v25.7,4.9 | JP10.3 9.94,3.74 11.2,5 11.2,6.6 10.4,7.4 9.28,7.4 JP4.3 | 10,12.4 9.4,11.8
  Bottom 0.4: JP6.3 JP10.3 | JP4.3 JP4.3@2 9.28,11.68 9.4,11.8
MOSI.PA7  (via drill 0.3)
  Top 0.2: U2.14 24.4,6.85 23.9,6.4 v23.9,4.5
  Bottom 0.2: JP10.2 7,4 7.4,4 8.4,5 8.4,6.7 7.7,7.4 7.2,7.4 6.8,7.8 | 7.4,12.4 6.8,12.4 6.8,11.67 JP4.2 | 7.4,12.4 7.7,12.4 8.7,13.4 12.4,13.4 13.2,14.2 22.8,14.2 24,13 24,11.8 24.4,11.4 24.4,7 25.7,5.7 25.9,5.7 26.4,5.2 26.4,4.6 26,4.2 24.2,4.2 v23.9,4.5 | 7.4,12.4 7,12
  Bottom 0.4: 6.8,8.25 6.8,11.55 JP4.2 | 6.8,7.8 6.8,8.25 | 6.8,8.25 JP4.2@2 | JP6.2 JP10.2
N$1
  Top 0.2: 35.4,5.2 35.4,5.4 Q1.2 Q1.5 | 35.4,5.2 35.4,4.65 Q1.3 | R23.2 33.8,5.2 35.4,5.2
N$2  (via drill 0.3)
  Top 0.2: v36.6,6.2 37.4,6.2 37.4,6 | 37.4,6 R24.2 38.85,6 | Q1.6 37.35,6.05 37.4,6 | v36.6,3.4 35.75,3.4 Q14.1
  Bottom 0.2: v36.6,3.4 v36.6,6.2
N$3  (via drill 0.3)
  Top 0.2: U2.38 10.7,22.7 11.2,22.2 18.7,22.2 v19.9,21 | v34.2,12.2 34.6,11.8 36,11.8 36.4,11.4 R29.1
  Bottom 0.2: v19.9,21 20.3,21 21.6,19.7 21.6,17.6 22.8,16.4 23.3,16.4 23.5,16.2 25,16.2 28.6,12.6 33.8,12.6 v34.2,12.2
N$4
  Top 0.2: LED1.C R19.1
N$5
  Top 0.2: LED3.C R17.1
N$6
  Top 0.2: LED2.C R18.1
N$7  (via drill 0.3)
  Top 0.2: U2.4 9.4,6.85 9.4,7.2 12.2,10 14.4,10 15.8,11.4 17.2,11.4 18.2,12.4 18.2,15.8 18.8,16.4 21.5,16.4 v21.6,16.5 | v33.2,11.8 33.6,11.4 35.8,11.4 36.6,10.6 R27.2
  Bottom 0.2: v21.6,16.5 22.1,16 23.1,16 23.3,15.8 24.8,15.8 28.4,12.2 32.8,12.2 v33.2,11.8
N$8
  Top 0.2: R10.1 47.8,9 48.4,9.6 R9.1 50.8,9.6 50.95,9.75 Q12.1 51.15,9.8 57.8,9.8 57.85,9.75 Q13.1
N$9
  Top 0.2: Q12.3 53.3,8.9 53.4,9 R12.2
N$10
  Top 0.2: R11.2 60.1,9 Q13.3
N$11  (via drill 0.3)
  Top 0.2: U2.5 11,6.95 11,8.2 12.4,9.6 14.6,9.6 16,11 17.4,11 18.6,12.2 18.6,15.6 19,16 21,16 v21.6,15.4 | v35.2,10.6 35.6,10.6 36.4,9.8 R28.1
  Bottom 0.2: v35.2,10.6 34.8,11 33,11 32.2,11.8 28.2,11.8 24.6,15.4 23.1,15.4 22.9,15.6 21.8,15.6 v21.6,15.4
N$12  (via drill 0.3)
  Top 0.2: U2.37 12.2,23 12.6,22.6 18.9,22.6 19.7,21.8 v20.5,21.8 | v35.2,12.6 35.6,12.2 R30.1
  Bottom 0.2: v20.5,21.8 21,21.3 21,20.9 22,19.9 22,17.8 23,16.8 23.5,16.8 23.7,16.6 25.2,16.6 28.8,13 34.8,13 v35.2,12.6
N$14
  Bottom 0.2: R33.2 11.76,23.21 IC1.4
  Bottom 0.6: IC1.2 IC1.4
N$16
  Top 0.2: USB1.A7 59.25,20.45 57.15,20.45 R32.1 56.28,19.5 R32.1
N$17  (via drill 0.3)
  Top 0.2: USB1.A5 58.31,18.91 v56.6,17.2
  Bottom 0.2: v56.6,17.2 R25.1
N$18  (via drill 0.3)
  Top 0.2: USB1.B5 58.19,21.91 56.8,23.3 R26.2
  other vias: 56.8,23.9
N$19
  Top 0.2: R31.2 57.4,19.9 USB1.A6
N$20
  Bottom 0.2: R7.1 16.55,18 Q11.1
N$21
  Top 0.2: R35.2 56.6,18.5 56.6,18.7 57.1,18.7 | 57.1,18.7 57.81,19.41 USB1.B7 61.3,19.4 61.39,19.31 X2.2 X1.2 | 57.1,18.7 56.8,18.4
N$22
  Top 0.2: 57.8,21.3 58.19,20.91 USB1.B6 60,20.9 60.9,20 61.2,20 61.24,19.96 X2.3 X1.3 | 57.8,21.3 57.54,21.56 R36.1 | 57.8,21.3 57.8,21.6 57.7,21.7
N$23
  Bottom 0.2: R8.1 19.75,19.45 19.15,19.45 19,19.6 Q10.1
N$27
  Top 0.2: Q7.2 Q7.5 61.8,13.6 61.8,14.3 Q7.6 61.9,14.2 63,14.2 R3.2
N$28
  Top 0.2: 56.1,15.6 56.4,15.6 57.2,14.8 57.2,14.2 58.4,13 59.7,13 Q7.3 | 56.1,15.6 54.4,15.6 R4.2 | Q2.1 56.1,15.6
N$29
  Bottom 0.2: Q17.5 5.6,20 | 5.6,20 Q17.2 | R5.2 5.6,22 5.6,20 | Q17.3 5.95,19.25 5.6,19.6 5.6,20
N$30
  Bottom 0.2: Q3.1 3.8,18.35 3.8,20.6 4,20.8 | 4,20.8 4,22 R6.2 | Q17.6 4.6,20.8 4,20.8
PB14
  Bottom 0.4: JP8.9 JP8.9@2 JP11.9 JP1.9
RED  (via drill 0.3)
  Top 0.2: U2.9 16.7,6.9 17,7.2 17,7.6 19.3,9.9 20.9,9.9 23.1,12.1 v24.7,12.1 | v30.2,9.9 30.2,9.6 29.2,8.6 29.2,7.8 28.6,7.2 R17.2
  Bottom 0.2: v24.7,12.1 25.5,12.1 27.6,10 30.2,10 v30.2,9.9
RX  (via drill 0.3)
  Top 0.2: R30.2 41.4,12 52,12 v52.4,11.6
  Bottom 0.2: JP8.6 v52.41,11.61 v52.4,11.6
  Bottom 0.4: JP8.6 JP8.6@2 JP11.6 JP1.6
SWCLK  (via drill 0.3)
  Top 0.2: R27.1 v42.3,10.6 42.3,10.8
  Bottom 0.2: JP8.2 v42.3,10.6
  Bottom 0.4: JP8.2 JP8.2@2 JP11.2 JP1.2
SWDIO  (via drill 0.3)
  Top 0.2: R28.2 47,9.8 v47.4,10.2
  Bottom 0.2: JP8.4 47.38,10.82 v47.4,10.2
  Bottom 0.4: JP8.4 JP8.4@2 JP11.4 JP1.4
TX  (via drill 0.3)
  Top 0.2: R29.2 49.5,11.4 v49.9,11
  Bottom 0.2: JP8.5@2 49.92,11.12 v49.9,11
  Bottom 0.4: JP8.5@2 JP8.5 JP11.5 JP1.5
USB_5V  (via drill 0.3)
  Top 0.2: Q7.1 58.85,14.35 58.4,14.8 Q2.3 | X2.1 X1.1
  Top 0.4: X2.1 60.76,18.66 v60.6,18.5
  Top 0.6: USB1.A4_B9 58.14,17.76 v57.9,17.5 57.6,17.2 57.6,15.5 Q2.3 | v57.8,23.3 57.8,23.2 58.44,22.56 USB1.B4_A9
  Bottom 0.6: v57.9,17.5 58.6,18.2 60.3,18.2 v60.6,18.5 60.6,21.2 60,21.8 59.3,21.8 v57.8,23.3